# Altium project BOOSTController.PrjPcb
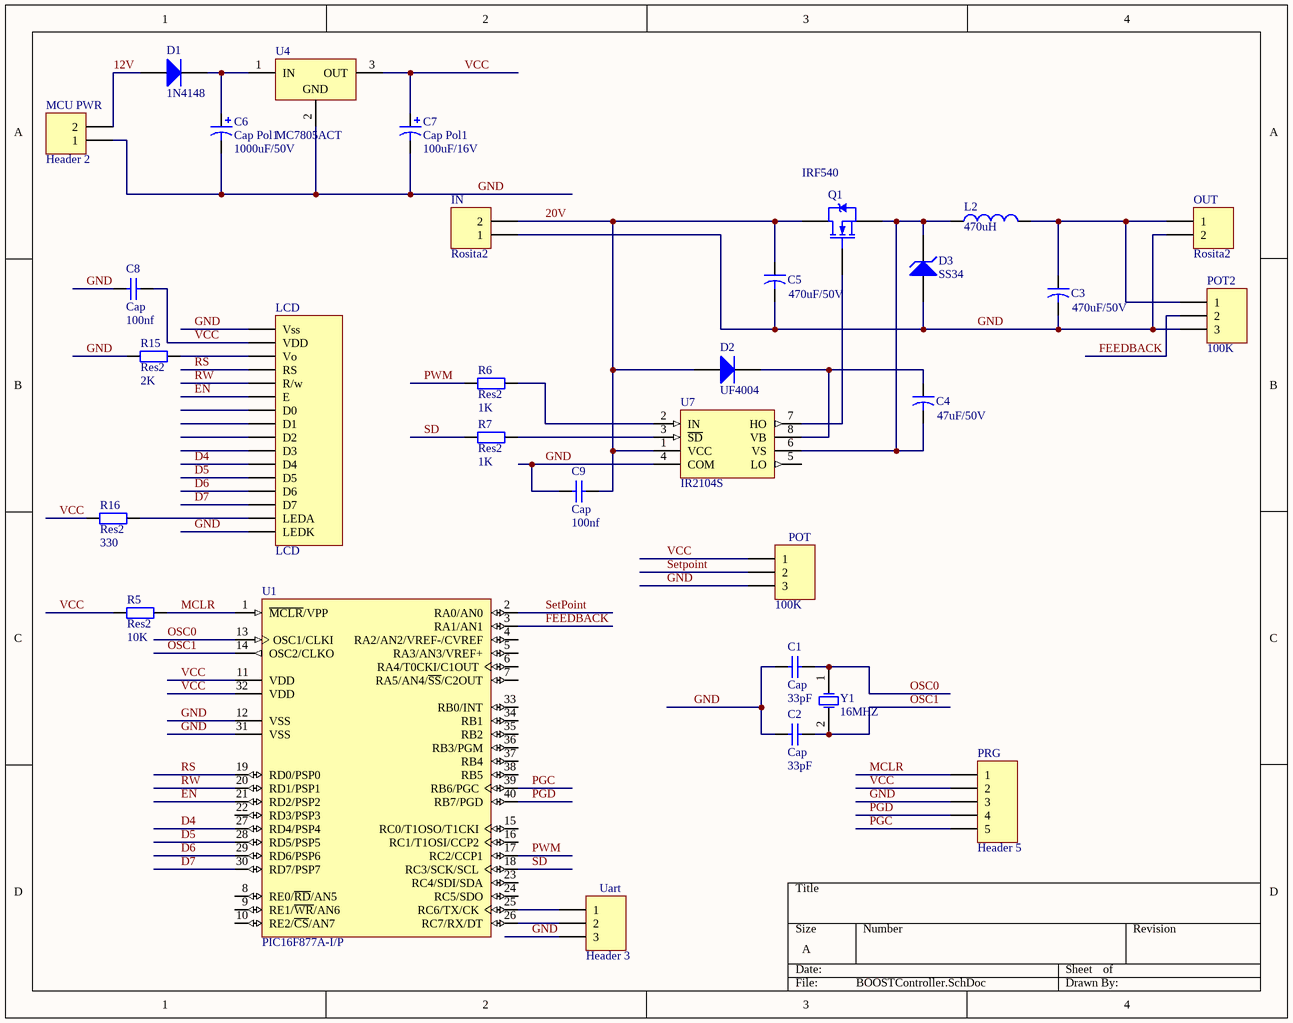
[diagram p0: BOOSTController.SchDoc]
1 sheet, 31 parts. Net scope: global (net labels, ports and power ports of the same name join across sheets).
Board file: BOOSTController.PcbDoc

## Sheet BOOSTController.SchDoc
size A

### Parts
C1  Cap  value 33pF  [RAD-0.1]
C2  Cap  value 33pF  [RAD-0.1]
C3  value 470uF/50V  [SMC7343P]
C4  value 47uF/50V  [SMC7343P]
C5  value 470uF/50V  [SMC7343P]
C6  Cap Pol1  value 1000uF/50V  [RB5-10.5]
C7  Cap Pol1  value 100uF/16V  [RB5-10.5]
C8  Cap  value 100nf  [RAD-0.1]
C9  Cap  value 100nf  [RAD-0.1]
D1  1N4148  [DO-35]
D2  UF4004  [DO-35]
D3  SS34  [SMC]
IN  Rosita2  [Rosita2]
L2  value 470uH  [L125]
LCD  LCD  [HDR1X16]
MCU_PWR  Header 2  [HDR1X2]
OUT  Rosita2  [Rosita2]
POT  100K  [HDR1X3]
POT2  100K  [HDR1X3]
PRG  Header 5  [HDR1X5]
Q1  IRF540  [TO-220AB]
R5  Res2  value 10K  [AXIAL-0.4]
R6  Res2  value 1K  [AXIAL-0.4]
R7  Res2  value 1K  [AXIAL-0.4]
R15  Res2  value 2K  [AXIAL-0.4]
R16  Res2  value 330  [AXIAL-0.4]
U1  PIC16F877A-I/P  [PDIP600-P40]
U4  MC7805ACT  [221A-04]
U7  IR2104S  [SO-8_N]
Uart  Header 3  [HDR1X3]
Y1  16MHZ  [CrystalClock]

### Nets
12V: D1.1(A) MCU_PWR.2
20V: C5.1 C9.1 D2.1(A) IN.2 Q1.2(D) U7.1(VCC)
D4: LCD.11(D4) U1.27(RD4/PSP4)
D5: LCD.12(D5) U1.28(RD5/PSP5)
D6: LCD.13(D6) U1.29(RD6/PSP6)
D7: LCD.14(D7) U1.30(RD7/PSP7)
EN: LCD.6(E) U1.21(RD2/PSP2)
FEEDBACK: POT2.2 U1.3(RA1/AN1)
GND: C1.1 C2.1 C3.2 C5.2 C6.2 C7.2 C8.2 C9.2 D3.1(A) IN.1 LCD.1(Vss) LCD.16(LEDK) MCU_PWR.1 OUT.2 POT.3 POT2.3 PRG.3 R15.2 U1.12(VSS) U1.31(VSS) U4.2(GND) U7.4(COM) Uart.3
MCLR: PRG.1 R5.1 U1.1(~{MCLR}/VPP)
OSC0: C1.2 U1.13(OSC1/CLKI) Y1.1(OSC1)
OSC1: C2.2 U1.14(OSC2/CLKO) Y1.2(OSC2)
PGC: PRG.5 U1.39(RB6/PGC)
PGD: PRG.4 U1.40(RB7/PGD)
PWM: R6.2 U1.17(RC2/CCP1)
RS: LCD.4(RS) U1.19(RD0/PSP0)
RW: LCD.5(R/w) U1.20(RD1/PSP1)
SD: R7.2 U1.18(RC3/SCK/SCL)
SetPoint: POT.2 U1.2(RA0/AN0)
VCC: C7.1 C8.1 LCD.2(VDD) POT.1 PRG.2 R5.2 R16.2 U1.11(VDD) U1.32(VDD) U4.3(OUT)
NetC3_1: C3.1 L2.2 OUT.1 POT2.1
NetC4_1: C4.1 D2.2(K) U7.8(VB)
NetC4_2: C4.2 D3.2(K) L2.1 Q1.3(S) U7.6(VS)
NetC6_1: C6.1 D1.2(K) U4.1(IN)
NetLCD_3: LCD.3(Vo) R15.1
NetLCD_15: LCD.15(LEDA) R16.1
NetQ1_1: Q1.1(G) U7.7(HO)
NetR6_1: R6.1 U7.2(IN)
NetR7_1: R7.1 U7.3(~{SD})
NetU1_25: U1.25(RC6/TX/CK) Uart.1
NetU1_26: U1.26(RC7/RX/DT) Uart.2

Not connected (* = marked no-connect by the designer): LCD 7(D0) 8(D1) 9(D2) 10(D3); U1 4(RA2/AN2/VREF-/CVREF) 5(RA3/AN3/VREF+) 6(RA4/T0CKI/C1OUT) 7(RA5/AN4/~{SS}/C2OUT) 8(RE0/~{RD}/AN5) 9(RE1/~{WR}/AN6) 10(RE2/~{CS}/AN7) 15(RC0/T1OSO/T1CKI) 16(RC1/T1OSI/CCP2) 22(RD3/PSP3) 23(RC4/SDI/SDA) 24(RC5/SDO) 33(RB0/INT) 34(RB1) 35(RB2) 36(RB3/PGM) 37(RB4) 38(RB5); U7 5(LO)

### Library data of the parts
C1 C2 C8 C9 = Cap: Capacitor; Published: 8-Jun-2000; LatestRevisionDate: 17-Jul-2002; LatestRevisionNote: Re-released for DXP Platform.; PackageReference: RAD-0.3; Publisher: Altium Limited
C3-C5 = Cap2: Capacitor; Published: 23-Sep-2002; PackageReference: CAPR5-4X5; Publisher: Altium Limited; PackageDescription: Capacitor; 2 Leads
C6 C7 = Cap Pol1: Polarized Capacitor (Radial); Published: 8-Jun-2000; LatestRevisionDate: 17-Jul-2002; LatestRevisionNote: Re-released for DXP Platform.; PackageReference: RB7.6-15; Publisher: Altium Limited; PackageDescription: Polarized Capacitor (Radial); 2 Leads
D1 D2 = 1N4148: High Conductance Fast Diode; Published: 8-Jun-2000; LatestRevisionDate: 17-Jul-2002; LatestRevisionNote: Re-released for DXP Platform.; DatasheetDocument: 1997; PackageReference: DO-35; Publisher: Altium Limited; Code_JEDEC: DO-204-AH; ComponentLink1Description: Manufacturer Link; ComponentLink1URL: http://www.fairchildsemi.com/; ComponentLink2Description: Datasheet; ComponentLink2URL: http://www.fairchildsemi.com/ds/1N%2F1N4148.pdf
D3 = D Zener: Schottky Diode [SS34]; Published: 8-Jun-2000; LatestRevisionDate: 17-Jul-2002; LatestRevisionNote: Re-released for DXP Platform.; PackageReference: DIODE-0.7; Publisher: Altium Limited; PackageDescription: Diode, Thru-Hole; 2 Leads; 0.7 in Pin Spacing
L2 = Inductor: Code_IEC: 1005; Published: 8-Jun-2000; LatestRevisionDate: 29-May-2009; LatestRevisionNote: IPC-7351 Footprint Added.; PackageReference: 0402-A; Publisher: Altium Limited; PackageDescription: Chip Inductor; Code_JEITA: 0402
MCU_PWR = Header 2: Header, 2-Pin; LatestRevisionDate: 17-Jul-2002; LatestRevisionNote: Re-released for DXP Platform.; Publisher: Altium Limited
POT POT2 Uart = Header 3: Header, 3-Pin; LatestRevisionDate: 17-Jul-2002; LatestRevisionNote: Re-released for DXP Platform.; Publisher: Altium Limited
PRG = Header 5: Header, 5-Pin; LatestRevisionDate: 17-Jul-2002; LatestRevisionNote: Re-released for DXP Platform.; Publisher: Altium Limited
Q1 = IRFZ44N: HEXFET Power MOSFET; Note: Pin 2 is electrically connected to pin 4.; Published: 8-Jun-2000; LatestRevisionDate: 17-Jul-2002; LatestRevisionNote: Re-released for DXP Platform.; DatasheetVersion: Aug-1997; PackageVersion: Feb-1997; PackageReference: TO-220AB; Publisher: Altium Limited; PackageDescription: TO, Thru-Hole, Vertical, Heatsink Mounted; 3 In-Line Leads; Pitch 2.54 mm; ComponentLink1Description: Manufacturer Link; ComponentLink1URL: http://www.irf.com/; ComponentLink2Description: Datasheet; ComponentLink2URL: http://www.irf.com/product-info/datasheets/data/irfz44n.pdf
R5-R7 R15 R16 = Res2: Resistor; Published: 8-Jun-2000; LatestRevisionDate: 17-Jul-2002; LatestRevisionNote: Re-released for DXP Platform.; PackageReference: AXIAL-0.4; Publisher: Altium Limited; PackageDescription: Axial Device, Thru-Hole; 2 Leads; 0.4 in Pin Spacing
U1 = PIC16F877A-I/P: Enhanced FLASH Microcontroller, 8K (x14-Bit words) FLASH, 368 Bytes RAM, 40-Pin PDIP, Standard VDD Range, Industrial Temperature; ComponentAvailability: Unknown. Contact manufacturer to determine status.; Published: 11-Oct-2004; LatestRevisionDate: 29-Jan-2009; LatestRevisionNote: Sch. layout revised. 3D Model Removed.; DatasheetVersion: revB, Oct-2003; PackageVersion: revBB, Aug-2009; PackageReference: PDIP600-P40; Publisher: Altium Limited; PackageDescription: 40-Lead Plastic Dual In-Line (P) - 600 mil Body [PDIP]; Supplier 1: Digi-Key; Supplier Part Number 1: PIC16F877A-I/P-ND; Supplier 2: Farnell; Supplier Part Number 2: 1523966; Supplier 3: Farnell; Supplier Part Number 3: 9761446; ComponentLink1Description: Datasheet; ComponentLink1URL: http://ww1.microchip.com/downloads/en/DeviceDoc/39582b.pdf; ComponentLink2Description: Packaging Specification; ComponentLink2URL: http://www.microchip.com/stellent/groups/techpub_sg/documents/packagingspec/en012702.pdf; ComponentLink3Description: Microchip.com Home; ComponentLink3URL: http://www.microchip.com/
U4 = MC7805ACT: 3-Terminal Positive Fixed Voltage Regulator; Note: Pin 2 is electrically connected to TAB; Published: 17-Jul-2002; DatasheetVersion: 1988; PackageReference: 221A-04; Publisher: Altium Limited; PackageDescription: TO, Thru-Hole, Vertical, Heatsink Mounted; 3 In-Line Leads; Pitch 2.54 mm; Code_JEDEC: TO-262-AA; ComponentLink1Description: Manufacturer Link; ComponentLink1URL: http://www.onsemi.com/site/products/taxonomy/0,4438,503,00.html; ComponentLink2Description: Datasheet; ComponentLink2URL: http://www.onsemi.com/pub/Collateral/MC7800-D.PDF
U7 = IR2104S: High and Low Side Driver; Published: 8-Jun-2000; LatestRevisionDate: 13-Apr-2006; LatestRevisionNote: IPC-7351 Footprint Added.; DatasheetVersion: PD600461; PackageVersion: Feb-2001; PackageReference: SO-8; Publisher: Altium Limited; PackageDescription: 8-Pin Plastic Small Outline Integrated Circuit 1.27 mm Pitch; Code_JEDEC: MS-012-AA; Code_IPC: SOIC127P600-8; ComponentLink1Description: Manufacturer Link; ComponentLink1URL: http://www.irf.com/; ComponentLink2Description: Datasheet; ComponentLink2URL: http://www.irf.com/product-info/datasheets/data/ir2104.pdf
Y1 = XTAL: Crystal Oscillator; Published: 8-Jun-2000; LatestRevisionDate: 17-Jul-2002; LatestRevisionNote: Re-released for DXP Platform.; PackageReference: R38; Publisher: Altium Limited